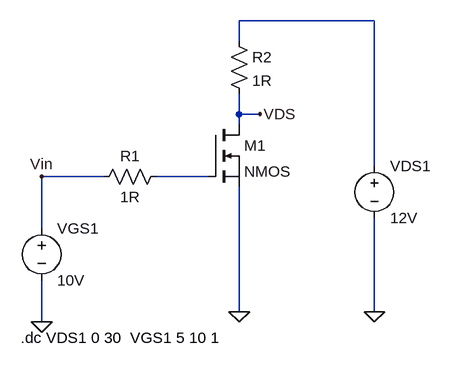
[diagram p0: schematic BS170_Transferkennlinie.asc]
BS170_Transferkennlinie.asc, the LTspice schematic file:
Version 4
SHEET 1 880 680
WIRE 416 -128 208 -128
WIRE 208 -96 208 -128
WIRE 208 16 208 -16
WIRE 240 16 208 16
WIRE 208 32 208 16
WIRE 416 96 416 -128
WIRE 0 112 -96 112
WIRE 160 112 80 112
WIRE -96 192 -96 112
WIRE 208 320 208 128
WIRE 416 320 416 176
WIRE -96 336 -96 272
FLAG 208 320 0
FLAG 416 320 0
FLAG -96 336 0
FLAG -96 112 Vin
FLAG 240 16 VDS
SYMBOL voltage 416 80 R0
SYMATTR InstName VDS1
SYMATTR Value 12V
SYMBOL voltage -96 176 R0
SYMATTR InstName VGS1
SYMATTR Value 10V
SYMBOL res -16 128 R270
WINDOW 0 32 56 VTop 2
WINDOW 3 0 56 VBottom 2
SYMATTR InstName R1
SYMATTR Value 1R
SYMBOL res 192 -112 R0
SYMATTR InstName R2
SYMATTR Value 1R
SYMBOL nmos 160 32 R0
SYMATTR InstName M1
TEXT -128 360 Left 2 !.dc VDS1 0 30  VGS1 5 10 1

The netlist it stands for:
* BS170_Transferkennlinie.asc
VDS1 N001 0 12V
VGS1 Vin 0 10V
R1 Vin N002 1R
R2 N001 VDS 1R
M1 VDS N002 0 0 NMOS
.model NMOS NMOS
.model PMOS PMOS
.lib standard.mos
.dc VDS1 0 30  VGS1 5 10 1
.backanno
.end